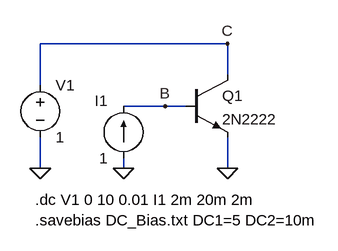
[diagram p0: schematic Fig_3-40_savebias_Tr-DC.asc]
Fig_3-40_savebias_Tr-DC.asc, the LTspice schematic file:
Version 4
SHEET 1 880 680
WIRE 256 64 -32 64
WIRE 256 112 256 64
WIRE -32 128 -32 64
WIRE 160 160 96 160
WIRE 192 160 160 160
WIRE -32 256 -32 208
WIRE 96 256 96 240
WIRE 256 256 256 208
FLAG 256 256 0
FLAG -32 256 0
FLAG 96 256 0
FLAG 160 160 B
FLAG 256 64 C
SYMBOL npn 192 112 R0
SYMATTR InstName Q1
SYMATTR Value 2N2222
SYMBOL voltage -32 112 R0
SYMATTR InstName V1
SYMATTR Value 1
SYMBOL current 96 240 R180
WINDOW 0 24 88 Left 2
WINDOW 3 24 0 Left 2
WINDOW 123 0 0 Left 2
WINDOW 39 0 0 Left 2
SYMATTR InstName I1
SYMATTR Value 1
TEXT -40 304 Left 2 !.dc V1 0 10 0.01 I1 2m 20m 2m
TEXT -40 336 Left 2 !.savebias DC_Bias.txt DC1=5 DC2=10m

The netlist it stands for:
* Fig_3-40_savebias_Tr-DC.asc
Q1 C B 0 0 2N2222
V1 C 0 1
I1 0 B 1
.model NPN NPN
.model PNP PNP
.lib standard.bjt
.dc V1 0 10 0.01 I1 2m 20m 2m
.savebias DC_Bias.txt DC1=5 DC2=10m
.backanno
.end